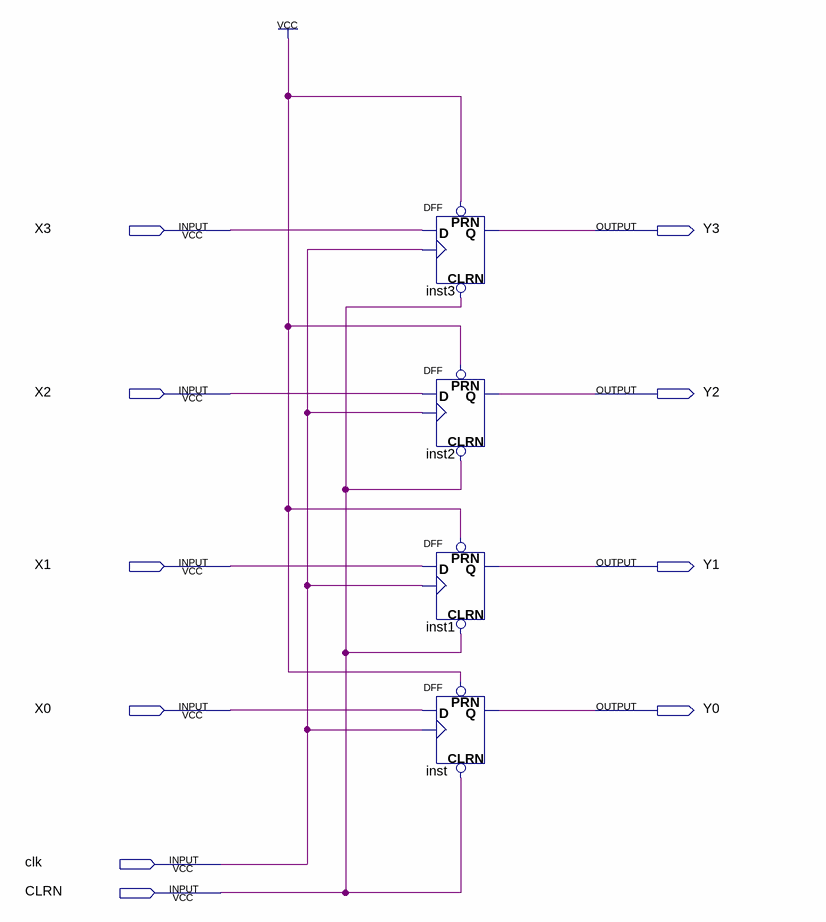
[diagram p0: schematic sheet]
// Quartus schematic register4bits.bdf as structural Verilog: 4 symbols, 10 pins
module register4bits (
  input  X3,
  input  X2,
  input  X1,
  input  X0,
  input  clk,
  input  CLRN,
  output Y3,
  output Y2,
  output Y1,
  output Y0
);

  DFF inst3 (.CLRN(CLRN), .CLK(clk), .D(X3), .PRN(1'b1), .Q(Y3));
  DFF inst2 (.CLRN(CLRN), .CLK(clk), .D(X2), .PRN(1'b1), .Q(Y2));
  DFF inst1 (.CLRN(CLRN), .CLK(clk), .D(X1), .PRN(1'b1), .Q(Y1));
  DFF inst (.CLRN(CLRN), .CLK(clk), .D(X0), .PRN(1'b1), .Q(Y0));
endmodule
